# Altium schematic sheet MCU.SchDoc
size A4; SheetNumber: 4; SheetTotal: 4
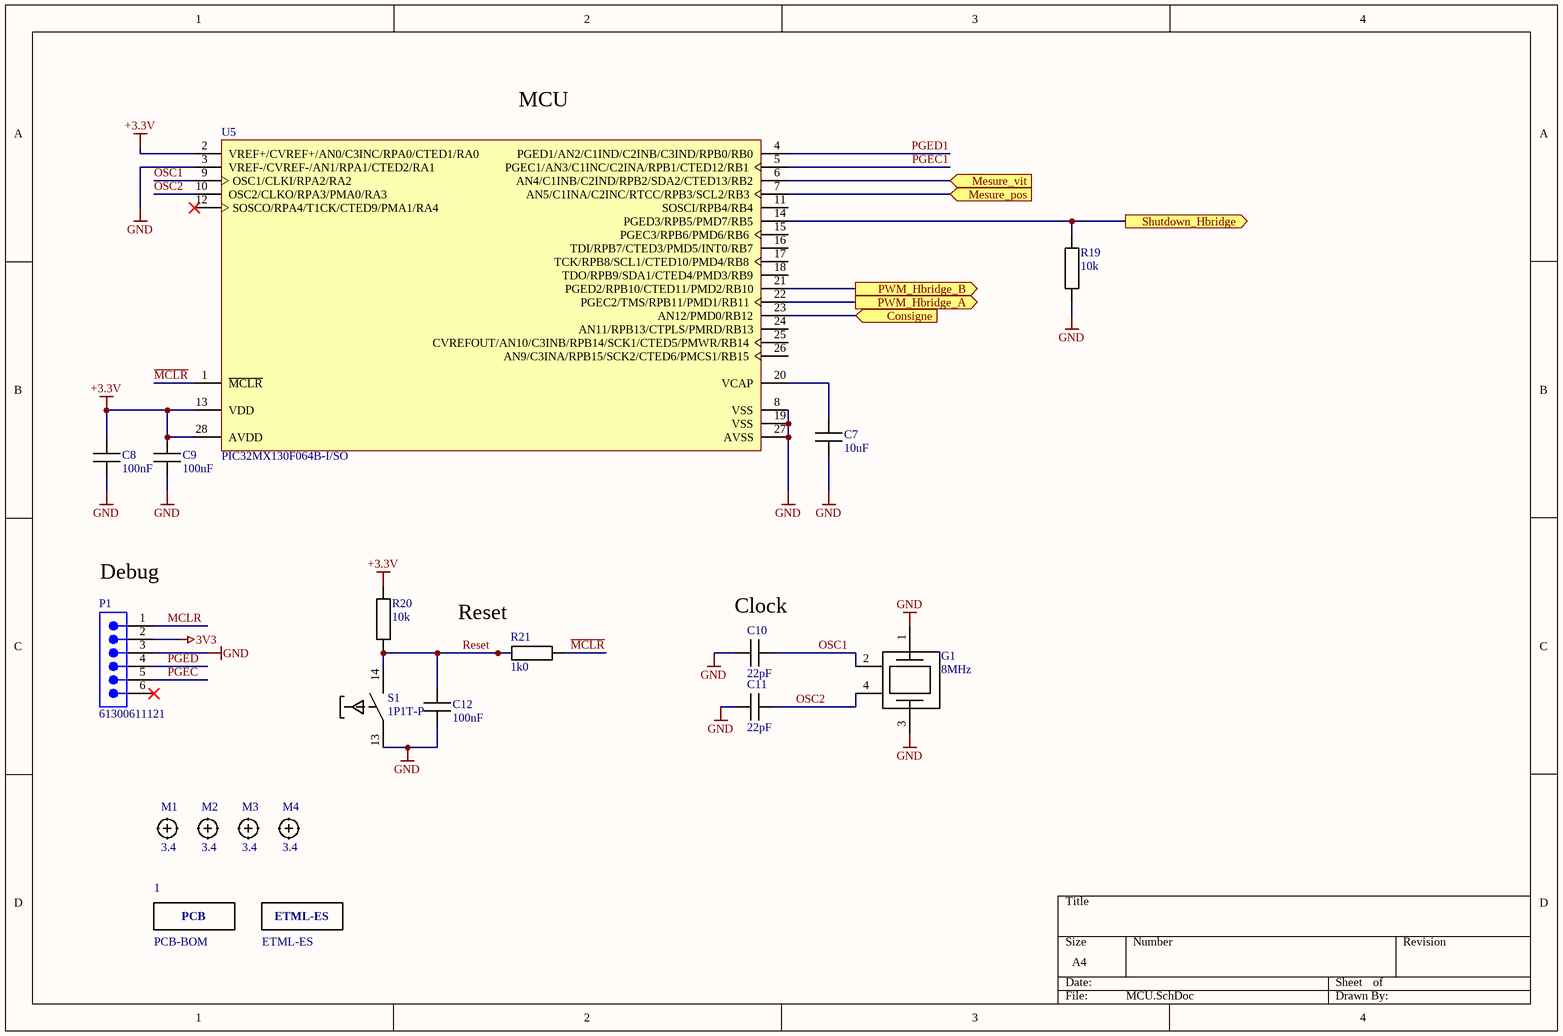
[diagram p0: MCU.SchDoc]

## Parts
1  PCB-BOM  (mechanical)
2  ETML-ES  [ETML-ES-CU-Footprint-1]  (no BOM)
C7  10uF  [CAPC2012X08M]
C8  100nF  [CAPC2012X08M]
C9  100nF  [CAPC2012X08M]
C10  22pF  [CAPC2012X08M]
C11  22pF  [CAPC2012X08M]
C12  100nF  [CAPC2012X08M]
G1  8MHz  [OSC60X35X10]
M1  3.4  [MECH-UHD340]  (no BOM)
M2  3.4  [MECH-UHD340]  (no BOM)
M3  3.4  [MECH-UHD340]  (no BOM)
M4  3.4  [MECH-UHD340]  (no BOM)
P1  61300611121  [61300611121]
R19  10k  [RESC2012X06M]
R20  10k  [RESC2012X06M]
R21  1k0  [RESC2012X06M]
S1  1P1T-P  [TE_1825910-6]
U5  PIC32MX130F064B-I/SO  [MCHP-SOIC-SO28_L]

## Ports
Consigne (in), Mesure_pos (in), Mesure_vit (in), PWM_Hbridge_A (out), PWM_Hbridge_B (out), Shutdown_Hbridge (out)

## Nets
3V3: P1.2
+3.3V: C8.2 C9.2 R20.2 U5.2(VREF+/CVREF+/AN0/C3INC/RPA0/CTED1/RA0) U5.13(VDD) U5.28(AVDD)
GND: C7.1 C8.1 C9.1 C10.2 C11.2 C12.1 G1.1 G1.3 P1.3 R19.1 S1.13 U5.3(VREF-/CVREF-/AN1/RPA1/CTED2/RA1) U5.8(VSS) U5.19(VSS) U5.27(AVSS)
Consigne: U5.23(AN12/PMD0/RB12) ; port Consigne
~{MCLR}: R21.2 U5.1(~{MCLR})
MCLR: P1.1
Mesure_pos: U5.7(AN5/C1INA/C2INC/RTCC/RPB3/SCL2/RB3) ; port Mesure_pos
Mesure_vit: U5.6(AN4/C1INB/C2IND/RPB2/SDA2/CTED13/RB2) ; port Mesure_vit
OSC1: C10.1 G1.2 U5.9(OSC1/CLKI/RPA2/RA2)
OSC2: C11.1 G1.4 U5.10(OSC2/CLKO/RPA3/PMA0/RA3)
PGEC: P1.5
PGEC1: U5.5(PGEC1/AN3/C1INC/C2INA/RPB1/CTED12/RB1)
PGED: P1.4
PGED1: U5.4(PGED1/AN2/C1IND/C2INB/C3IND/RPB0/RB0)
PWM_Hbridge_A: U5.22(PGEC2/TMS/RPB11/PMD1/RB11) ; port PWM_Hbridge_A
PWM_Hbridge_B: U5.21(PGED2/RPB10/CTED11/PMD2/RB10) ; port PWM_Hbridge_B
Reset: C12.2 R20.1 R21.1 S1.14
Shutdown_Hbridge: R19.2 U5.14(PGED3/RPB5/PMD7/RB5) ; port Shutdown_Hbridge
NetC7_2: C7.2 U5.20(VCAP)

Not connected (* = marked no-connect by the designer): P1 6*; U5 11(SOSCI/RPB4/RB4) 12(SOSCO/RPA4/T1CK/CTED9/PMA1/RA4)* 15(PGEC3/RPB6/PMD6/RB6) 16(TDI/RPB7/CTED3/PMD5/INT0/RB7) 17(TCK/RPB8/SCL1/CTED10/PMD4/RB8) 18(TDO/RPB9/SDA1/CTED4/PMD3/RB9) 24(AN11/RPB13/CTPLS/PMRD/RB13) 25(CVREFOUT/AN10/C3INB/RPB14/SCK1/CTED5/PMWR/RB14) 26(AN9/C3INA/RPB15/SCK2/CTED6/PMCS1/RB15)

## Notes on the sheet
- (near U5) MCU
- (near P1) Debug
- (near R21) Reset
- (near C10) Clock
- (in symbol CMP-064-000001-1) PCB

## Library data of the parts
1 = CMP-064-000001-1: PCB element for BOM; IsStocked: False; PN: PN-108075; Category: Others; SubCategory: Dessins; Supplier Price 1: 0; Supplier 1: Eurocircuits Sàrl; Value: PCB-BOM; Supplier Part Number 1: -
2 = CMP-063-000030-2: Logo ETML-ES; IsStocked: Fasle; Value: ETML-ES-CU; Category: Others; SubCategory: Dessins
C7 = CMP-065-000040-2: CAPC 10uF X5R 16V 10% 2012 (0805 INCH); Manufacturer Number: C2012X5R1C106K085AC; Manufacturer: TDK; IsStocked: 1; Value: 10µF; PN: PN-654987; TemperatureRange: -55°C to +85°C; Tolerance: ±10%; Voltage: 16V; SubCategory: Condensateurs ceramique; Dielectric: X5R; Supplier Part Number 1: FAB.0805_C 10u; Category: Passives; Supplier Price 1: 0.0360; Supplier 1: ETML
C8-C12 = CMP-065-000038-2: CAPC 100nF X7R 50V 10% 2012 (0805 INCH); Manufacturer Number: C2012X7R1H104K085AA; Manufacturer: TDK; IsStocked: 1; TemperatureRange: -55°C to +125°C; PN: PN-747862; Supplier Part Number 1: FAB.0805_C 100n; Supplier Price 1: 0.0200; Voltage: 50V; Dielectric: X7R; Value: 100nF; SubCategory: Condensateurs ceramique; Category: Passives; Tolerance: ±10%; Supplier 1: ETML
G1 = CMP-059-000009-3: CRYSTAL 8MHz 6.0x3.5mm; Manufacturer: Farnell Multicomp; Manufacturer Number: ILCX08-JH5F18-8.000MHZ; PN: PN-881279; Tolerance: ±30ppm; TemperatureRange: -20°C to +70°C; IsStocked: 0; Category: IntegratedCircuits; Value: 8MHz; Supplier 1: Farnell; Supplier Part Number 1: 3572991; Supplier Price 1: 0.45; SubCategory: Horloges; TemperatureCoeff: ±30ppm
M1-M4 = CMP-063-000009-1: Unplated Hole 3.4mm; PN: PN-491366; IsStocked: False; SubCategory: Mecaniques; Category: Others; Value: 3.4
P1 = CMP-1502-01070-3: NexarPartId: 20084590; Current Rating: 3A; Pitch: 2.54mm; Gender: Male; Operating Supply Voltage: 250V; Connector Type: Male Pin; Number of Positions: 6; Contact Resistance: 20mΩ; Packaging: Bulk; Number of Pins: 6; Number of Rows: 1; Contact Plating: Gold; Lead Free: Lead Free; RoHS: Compliant; Contact Mating Length: 5.9944mm; Voltage Rating: 250V; REACH SVHC: Unknown; Contact Gender: Male; Housing Material: PBT; Min Operating Temperature: -40°C; Lead Pitch: 2.54mm; Mount: Through Hole; Number of Contacts: 6; Max Operating Temperature: 105°C; Contact Material: Copper; Orientation: Vertical; Termination: Through Hole; Color: Black; Height: 8.89mm
R19 R20 = CMP-066-000199-2: RES 10kohm  ±1% 0.125W 2012 (0805 INCH); Manufacturer Number: RC0805FR-0710KL; Manufacturer: Yageo; PN: PN-374909; TemperatureCoeff: ±200ppm/°C; Voltage: 150V; TemperatureRange: -55°C to 155°C; IsStocked: 1; Tolerance: ±1%; Category: Passives; Value: 10k; Supplier Price 1: 0.0200; Supplier Part Number 1: FAB.0805_R 10k; Supplier 1: ETML; SubCategory: Resistances couche epaisse; Power: 0.125W
R21 = CMP-066-000187-2: RES 1.0kohm  ±1% 0.125W 2012 (0805 INCH); Manufacturer: Yageo; Manufacturer Number: RC0805FR-071KL; Value: 1k; PN: PN-746409; TemperatureRange: -55°C to 155°C; IsStocked: 1; TemperatureCoeff: ±200ppm/°C; Voltage: 150V; Supplier 1: ETML; SubCategory: Resistances couche epaisse; Supplier Price 1: 0.0200; Supplier Part Number 1: FAB.0805_R 1k0; Category: Passives; Tolerance: ±1%; Power: 0.125W
S1 = CMP-058-000005-2: SW 600X600X500 24V 50mA THT; Manufacturer Number: 1825910-6; Manufacturer: TE Connectivity; TemperatureRange: -35°C to +85 °C; IsStocked: True; PN: PN-638027; Voltage: 24V; Current: 50mA; SubCategory: Commutateurs; Category: Electromechanical; Supplier Part Number 1: 135-66-547; Supplier 1: Distrelec AG; Supplier Price 1: 0.1642; Value: 1P1T-P
U5 = CMP-0048-00454-1: 32-bit Microcontroller with Audio and Graphics Interface, USB and Advanced Analog, 40 MHz, 21 I/O, PMP, -40 to 85 degC, 28-pin SOIC (SO28), Tube; Manufacturer: Microchip; ComponentLink4URL: http://www.microchip.com/PIC32MX130F064B; DatasheetVersion: Rev. E; ComponentLink1URL: http://www.microchip.com; ComponentLink2URL: http://ww1.microchip.com/downloads/en/DeviceDoc/61168E.pdf; PackageDescription: 28-Lead Plastic Small Outline, 17.9 x 7.5 mm Body, 1.27 mm Pitch; PackageVersion: C04-052C; Mounting Technology: Surface Mount; ComponentLink2Description: Datasheet; ComponentLink3URL: http://www.microchip.com/stellent/groups/techpub_sg/documents/packagingspec/en012702.pdf; PartNumber: PIC32MX130F064B-I/SO; PackageReference: SOIC-SO28; ComponentLink1Description: Manufacturer URL; ComponentLink3Description: Package Specification; ComponentLink4Description: Product URL